# EAGLE design ESP32Board (EAGLE 9.6.2)
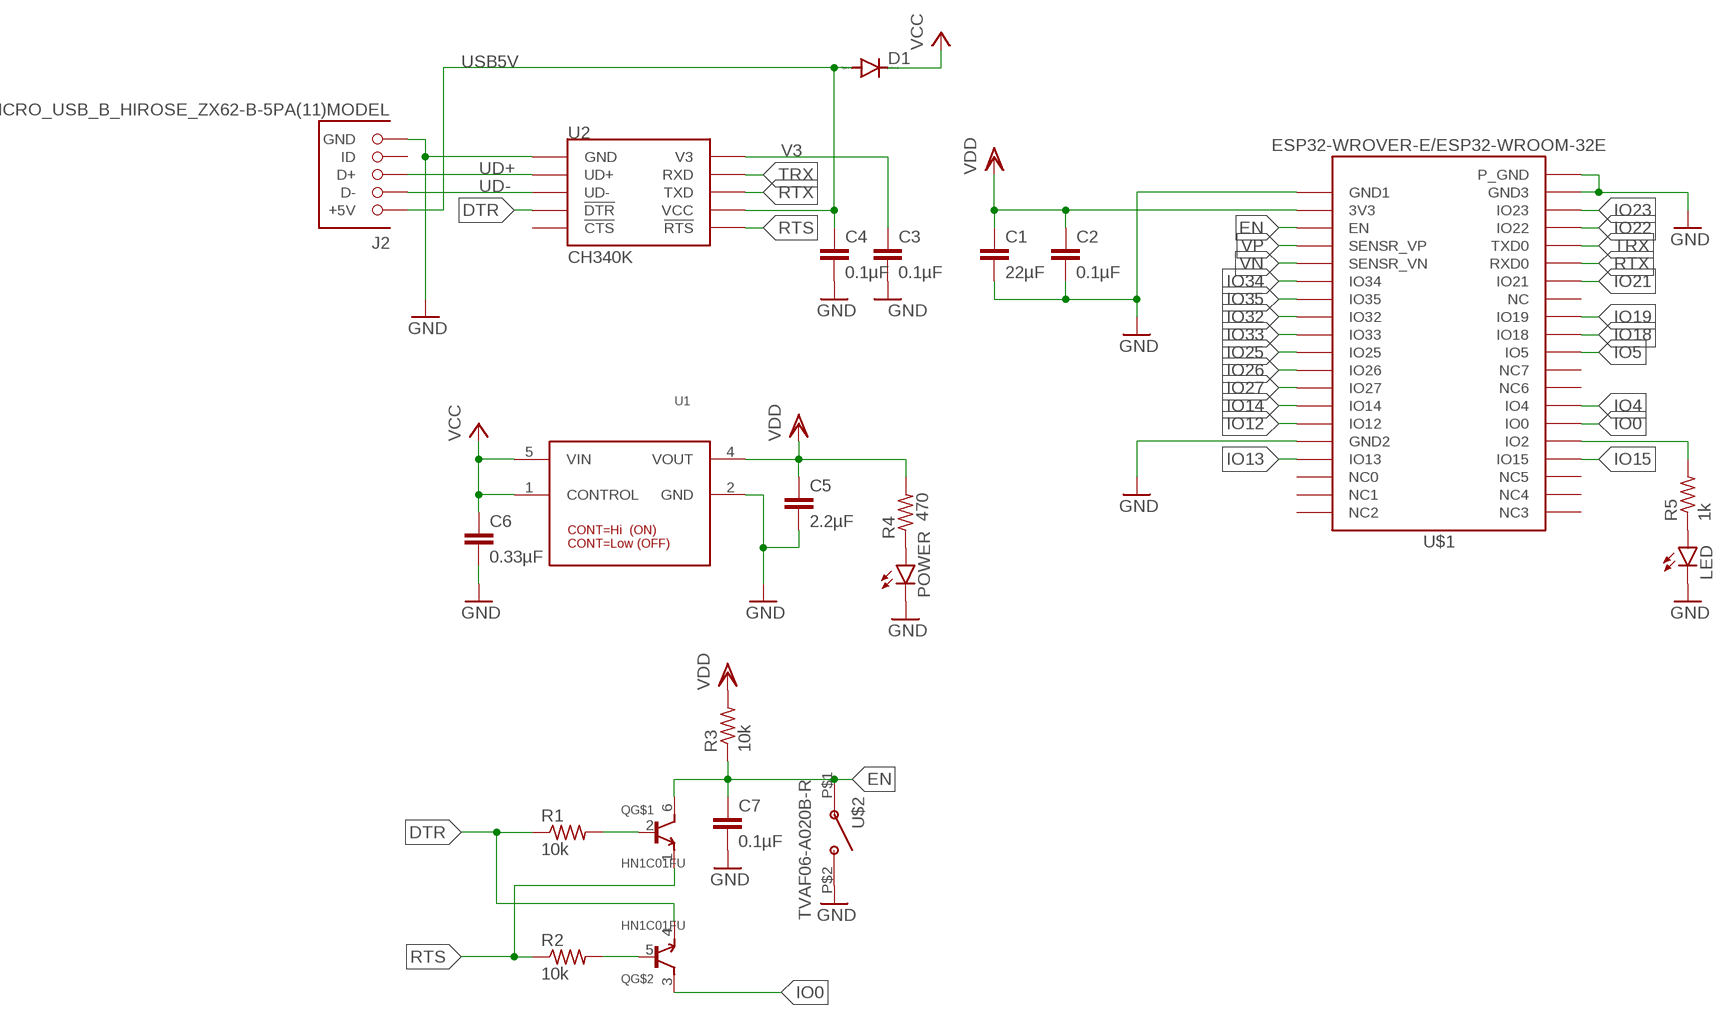
[diagram p0: schematic, sheet 1]

## Parts
C1  22µF  C-EUC0603K  [C0603K]
C2  0.1µF  C-EUC0603K  [C0603K]
C3  0.1µF  C-EUC0603K  [C0603K]
C4  0.1µF  C-EUC0603K  [C0603K]
C5  2.2µF  C-EUC0603K  [C0603K]
C6  0.33µF  C-EUC0603K  [C0603K]
C7  0.1µF  C-EUC0603K  [C0603K]
D1  DIODE-SOD123  [SOD123]
J2  MICRO_USB_B_HIROSE_ZX62-B-5PA(11)MODEL  [GHI-CONNECTORS_10118192-0001LF(MICRO-USB-B-AMPHENOL-FCI)]
LED  LEDCHIPLED_0603  [CHIPLED_0603]
POWER  LEDCHIPLED_0603  [CHIPLED_0603]
Q  HN1C01FU  [SOT-363]
R1  10k  R-US_R0603  [R0603]
R2  10k  R-US_R0603  [R0603]
R3  10k  R-US_R0603  [R0603]
R4  470  R-US_R0603  [R0603]
R5  1k  R-US_R0603  [R0603]
U1  I-10673_NJM2884U1-33  [NJM2884U1-33]
U2  CH340K  [ESSOP-10]
U$1  ESP32-WROVER-E/ESP32-WROOM-32E  [ESP32-WROVER-E/ESP32-WROOM-32E]
U$2  TVAF06-A020B-R  [TVAF06-A020B-R]

## Nets
DTR: Q.4(E) R1.1 U2.P4(!DTR!)
EN: C7.1 Q.6(C) R3.1 U$1.EN U$2.P$1(A)
GND: C1.2 C2.2 C3.2 C4.2 C5.2 C6.2 C7.2 J2.CGND1(GND) J2.CGND2(GND) J2.CGND3(GND) J2.CGND4(GND) J2.CGND5(GND) J2.CGND6(GND) J2.GND LED.C POWER.C U1.2(GND) U2.P0(GND) U2.P3(GND) U$1.GND1 U$1.GND2 U$1.GND2'(GND2) U$1.GND3 U$1.P_GND U$2.P$2(B)
IO0: Q.3(C) U$1.IO0
IO2: R5.2 U$1.IO2 U$1.IO2'(IO2)
IO4: U$1.IO4
IO5: U$1.IO5
IO12: U$1.IO12
IO13: U$1.IO13 U$1.IO13'(IO13)
IO14: U$1.IO14
IO15: U$1.IO15 U$1.IO15'(IO15)
IO18: U$1.IO18
IO19: U$1.IO19
IO21: U$1.IO21
IO22: U$1.IO22
IO23: U$1.IO23
IO25: U$1.IO25
IO26: U$1.IO26
IO27: U$1.IO27
IO32: U$1.IO32
IO33: U$1.IO33
IO34: U$1.IO34
IO35: U$1.IO35
N$1: LED.A R5.1
N$14: Q.2(B) R1.2
N$15: Q.5(B) R2.2
N$84: POWER.A R4.1
RTS: Q.1(E) R2.1 U2.P6(!RTS!)
RTX: U2.P8(TXD) U$1.RXD0
TRX: U2.P9(RXD) U$1.TXD0
UD+: J2.D+ U2.P1(UD+)
UD-: J2.D- U2.P2(UD-)
USB5V: C4.1 D1.A J2.VBUS(+5V) U2.P7(VCC)
V3: C3.1 U2.P10(V3)
VCC: C6.1 D1.C U1.1(CONTROL) U1.5(VIN)
VDD: C1.1 C2.1 C5.1 R3.2 R4.2 U1.4(VOUT) U$1.3V3
VN: U$1.SENSOR_VN(SENSR_VN)
VP: U$1.SENSOR_VP(SENSR_VP)
Unconnected: J2.ID U2.P5(!CTS!) U$1.IO16(NC6) U$1.IO17(NC7) U$1.NC U$1.NC0 U$1.NC0'(NC0) U$1.NC1 U$1.NC1'(NC1) U$1.NC2 U$1.NC2'(NC2) U$1.NC3 U$1.NC3'(NC3) U$1.NC4 U$1.NC4'(NC4) U$1.NC5 U$1.NC5'(NC5)

## Library data of the parts
C1-C7 = rcl:C-EU: CAPACITOR, European symbol; SPICEPREFIX: C
D1 = diode:DIODE-: DIODE
J2 = connector:MICRO_USB_B_HIROSE_ZX62-B-5PA(11): Connector Receptacle USB - micro B 2.0 5 Position Surface Mount, Right Angle, Horizontal Bottom Mount
LED POWER = led:LED: LED OSRAM: - CHIPLED LG R971, LG N971, LY N971, LG Q971, LY Q971, LO R971, LY R971 LH N974, LH R974 LS Q976, LO Q976, LY Q976 LO Q996 - Hyper CHIPLED LW Q18S LB Q993, LB Q99A, LB R99A - SideLED LS A670, LO A670, LY A670, LG A670, LP A670 LB A673, LV A673, LT A673, LW A673 LH A674 LY A675 LS A676, LA A676, LO A676, LY A676, LW A676 LS A679, LY A679, LG A679 - Hyper Micro SIDELED® LS Y876, LA Y876, LO Y876, LY Y876 LT Y87S - SmartLED LW L88C, LW L88S LB L89C, LB L89S, LG L890 LS L89K, LO L89K, LY L89K LS L896, LA L896, LO L896, LY L896 - TOPLED LS T670, LO T670, LY T670, LG T670, LP T670 LSG T670, LSP T670, LSY T670, LOP T670, LYG T670 LG T671, LOG T671, LSG T671 LB T673, LV T673, LT T673, LW T673 LH T674 LS T676, LA T676, LO T676, LY T676, LB T676, LH T676, LSB T676, LW T676 LB T67C, LV T67C, LT T67C, LS T67K, LO T67K, LY T67K, LW E67C LS E67B, LA E67B, LO E67B, LY E67B, LB E67C, LV E67C, LT E67C LW T67C LS T679, LY T679, LG T679 LS T770, LO T770, LY T770, LG T770, LP T770 LB T773, LV T773, LT T773, LW T773 LH T774 LS E675, LA E675, LY E675, LS T675 LS T776, LA T776, LO T776, LY T776, LB T776 LHGB T686 LT T68C, LB T68C - Hyper Mini TOPLED® LB M676 - Mini TOPLED Santana® LG M470 LS M47K, LO M47K, LY M47K Source: http://www.osram.convergy.de LUXEON: - LUMILED® LXK2-PW12-R00, LXK2-PW12-S00, LXK2-PW14-U00, LXK2-PW14-V00 LXK2-PM12-R00, LXK2-PM12-S00, LXK2-PM14-U00 LXK2-PE12-Q00, LXK2-PE12-R00, LXK2-PE12-S00, LXK2-PE14-T00, LXK2-PE14-U00 LXK2-PB12-K00, LXK2-PB12-L00, LXK2-PB12-M00, LXK2-PB14-N00, LXK2-PB14-P00, LXK2-PB14-Q00 LXK2-PR12-L00, LXK2-PR12-M00, LXK2-PR14-Q00, LXK2-PR14-R00 LXK2-PD12-Q00, LXK2-PD12-R00, LXK2-PD12-S00 LXK2-PH12-R00, LXK2-PH12-S00 LXK2-PL12-P00, LXK2-PL12-Q00, LXK2-PL12-R00 Source: www.luxeon.com KINGBRIGHT: KA-3528ASYC Source: www.kingbright.com
Q = transistors:HN1C01FU
R1-R5 = rcl:R-US_: RESISTOR, American symbol; SPICEPREFIX: R
U1 = akizuki:I-10673_NJM2884U1-33
U2 = CH340:CH340K
U$1 = esp32:ESP32-WROVER-E/ESP32-WROOM-32E
U$2 = switches:TVAF06-A020B-R

## Board
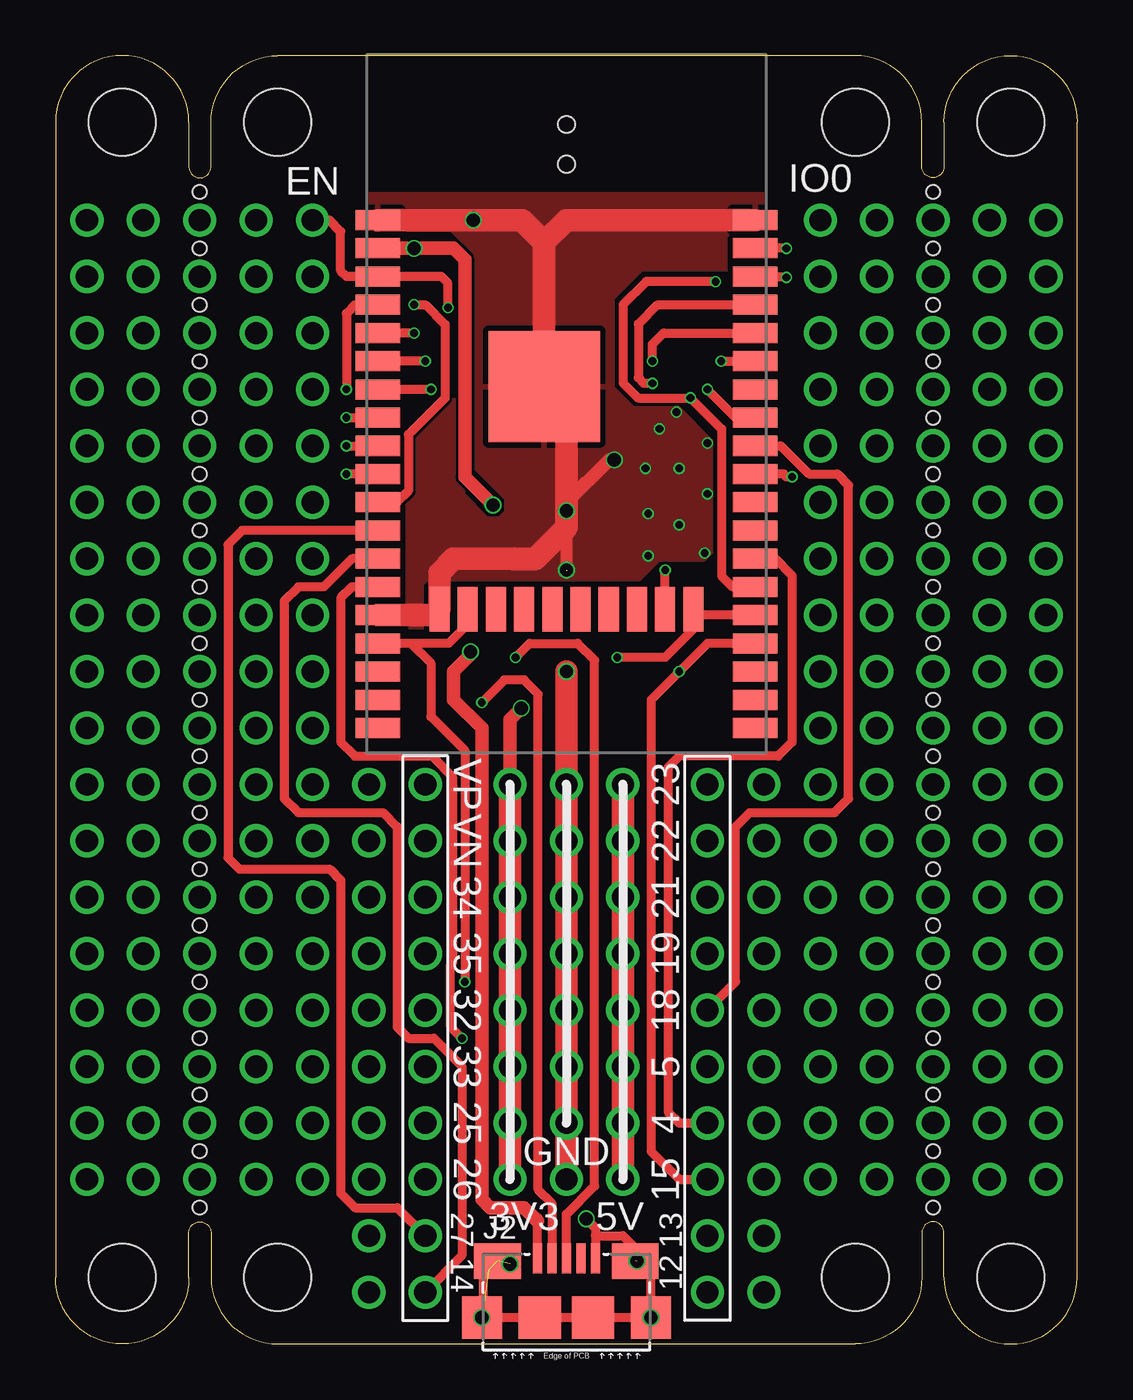
[diagram p1: board, top side]
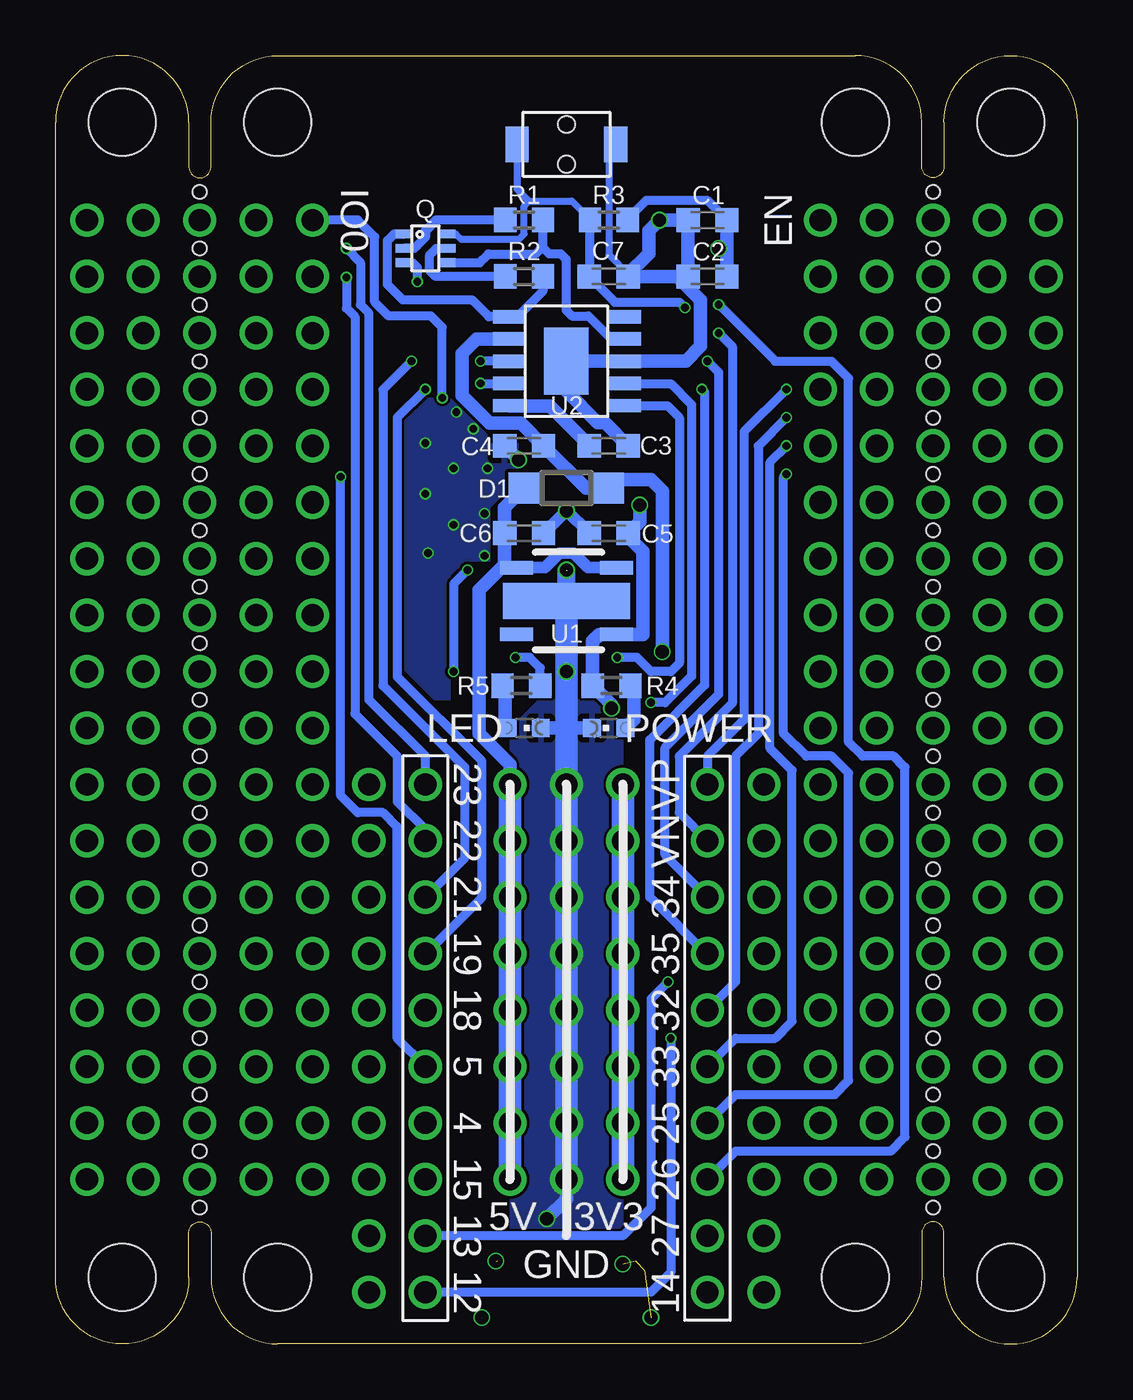
[diagram p2: board, bottom side, seen from below]

Size 46 x 58 mm. Coordinates in mm from the lower left corner, seen from the top.
Outline: 36,58 10,58 arc90 7,55 7,53 arc-180 6,53 6,55 arc180 0,55 0,3 arc180 6,3 6,5 arc-180 7,5 7,3 arc90 10,0 36,0 arc90 39,3 39,5 arc-180 40,5 40,3 arc180 46,3 46,55 arc180 40,55 40,53 arc-180 39,53 39,55 arc90 36,58
Copper layers (1*16): Top 0.035mm / dielectric 1mm / Bottom 0.035mm
Design rules "jlcpcb-2layers-1.0mm": minimum track width 5mil, minimum drill 0.3mm, track to track 5mil, track to pad 5mil, pad to pad 5mil, via to via 5mil, smd to smd 5mil, copper to edge 0.2mm, drill to drill 6mil, minimum pad ring 10mil, minimum via ring 3mil, stop-mask expansion 4mil, vias tented up to drill 0mil, thermal gap 10mil
Holes 3 mm at 10,55 3,55 36,55 43,55 36,3 43,3 10,3 3,3
Holes 0.6 mm at 6.49,49.32 6.49,46.78 6.49,44.24 6.49,41.7 6.49,39.16 6.49,36.62 6.49,34.08 6.49,31.54 6.49,29 6.49,26.46 6.49,23.92 6.49,21.38 6.49,18.84 6.49,16.3 6.49,13.76 6.49,11.22 6.49,8.68 6.49,6.14 6.49,51.86 39.51,51.86 39.51,49.32 39.51,46.78 39.51,44.24 39.51,41.7 39.51,39.16 39.51,36.62 39.51,34.08 39.51,31.54 39.51,29 39.51,26.46 39.51,23.92 39.51,21.38 39.51,18.84 39.51,16.3 39.51,13.76 39.51,11.22 39.51,8.68 39.51,6.14

### Footprints (pad centres in the part's own frame; a part is rotated, then mirrored left to right if it is on the bottom)
C0603K = smd 1.05 x 1.08: 1 -0.875,0; 2 0.875,0
SOD123 = smd 1.4 x 1.4: A 1.9,0; C -1.9,0
GHI-CONNECTORS_10118192-0001LF(MICRO-USB-B-AMPHENOL-FCI) = smd 1.8 x 1.9: CGND1 -3.8,0; CGND4 3.8,0 | smd 1.9 x 1.9: CGND2 -1.2,0; CGND3 1.2,0 | smd 2.1 x 1.6: CGND5 3.1,2.55; CGND6 -3.1,2.55 | smd 0.4 x 1.35: D+ 0,2.675; D- -0.65,2.675; GND 1.3,2.675; ID 0.65,2.675; VBUS -1.3,2.675
CHIPLED_0603 = smd 0.8 x 0.8: A 0,-0.75; C 0,0.75
SOT-363 = smd 0.4 x 0.8: 1 -0.65,-0.95; 2 0,-0.95; 3 0.65,-0.95; 4 0.65,0.95; 5 0,0.95; 6 -0.65,0.95
R0603 = smd 1 x 1.1: 1 -0.85,0; 2 0.85,0
NJM2884U1-33 = smd 0.6 x 1.5: 1 -1.5,-2.25; 3 1.5,-2.25; 4 1.5,2.25; 5 -1.5,2.25 | smd 1.6 x 5.7: 2 0,0
ESSOP-10 = smd 2 x 3: P0 0,0 | smd 1.5 x 0.6: P1 -2.6,2; P2 -2.6,1; P3 -2.6,0; P4 -2.6,-1; P5 -2.6,-2 | smd 1.4 x 0.6: P6 2.6,-2; P7 2.6,-1; P8 2.6,0; P9 2.6,1; P10 2.6,2
ESP32-WROVER-E/ESP32-WROOM-32E = smd 2 x 0.9: 3V3 -8.5,10.16; EN -8.5,8.89; GND1 -8.5,11.43; GND2 -8.5,-6.35; GND3 8.5,11.43; IO0 8.5,-5.08; IO2 8.5,-6.35; IO4 8.5,-3.81; IO5 8.5,0; IO12 -8.5,-5.08; IO13 -8.5,-7.62; IO14 -8.5,-3.81; IO15 8.5,-7.62; IO16 8.5,-2.54; IO17 8.5,-1.27; IO18 8.5,1.27; IO19 8.5,2.54; IO21 8.5,5.08; IO22 8.5,8.89; IO23 8.5,10.16; IO25 -8.5,0; IO26 -8.5,-1.27; IO27 -8.5,-2.54; IO32 -8.5,2.54; IO33 -8.5,1.27; IO34 -8.5,5.08; IO35 -8.5,3.81; NC 8.5,3.81; NC0 -8.5,-8.89; NC1 -8.5,-10.16; NC2 -8.5,-11.43; NC3 8.5,-11.43; NC4 8.5,-10.16; NC5 8.5,-8.89; RXD0 8.5,6.35; SENSOR_VN -8.5,6.35; SENSOR_VP -8.5,7.62; TXD0 8.5,7.62 | smd 0.9 x 2: GND2' -5.715,-6.08; IO2' 5.715,-6.08; IO13' -4.445,-6.08; IO15' 4.445,-6.08; NC0' -3.175,-6.08; NC1' -1.905,-6.08; NC2' -0.635,-6.08; NC3' 0.635,-6.08; NC4' 1.905,-6.08; NC5' 3.175,-6.08 | smd 5 x 5: P_GND -1,3.93
TVAF06-A020B-R = smd 1.6 x 1.05: P$1 0,2.225; P$2 0,-2.225 | hole 0.75: -0.9,0; 0.9,0

### Placement (x,y rotation side)
C1  16.65,50.59 180 bottom
C2  16.65,48.05 180 bottom
C3  21.09,40.43 0 bottom
C4  24.91,40.43 180 bottom
C5  21.09,36.49 180 bottom
C6  24.91,36.49 0 bottom
C7  21.09,48.05 0 bottom
D1  23,38.52 0 bottom
J2  23,1.19 0 top
LED  24.91,27.73 270 bottom
POWER  21.09,27.73 90 bottom
Q  29.35,49.32 270 bottom
R1  24.91,50.59 180 bottom
R2  24.91,48.05 180 bottom
R3  21.09,50.59 0 bottom
R4  20.97,29.64 180 bottom
R5  25.03,29.64 0 bottom
U1  23,33.45 270 bottom
U2  23,44.24 180 bottom
U$1  23,39.16 0 top
U$2  23,54 90 bottom

### Tracks (layer width: path | path; a pad name or v marks a point on that pad's centre or on a via)
DTR
  Bottom 0.406: U2.P4 20.98,45.24 22.01,46.27 22.75,46.27 23,46.53 23,48.81 23.25,49.07 23.76,49.07 24.05,49.36 24.05,49.41 | Q.4 26.91,48.67 26.51,49.07 24.4,49.07 24.05,49.41 | 24.05,49.41 R1.1
EN  (via drill 0.35, 1 pad 1.5)
  Top 0.406: v17.67,46.65 17.67,47.75 17.37,48.05 U$1.EN 13.09,48.05 12.84,48.3 12.84,50.08 12.33,50.59 v11.57,50.59
  Bottom 0.305: R3.1 21.95,50.64 22.75,51.45 24.68,51.45 | 24.68,51.45 24.91,51.22 24.91,49.96 25.13,49.73 27.75,49.73 27.98,49.97 Q.6 | U$2.P$1 25.23,51.99 24.68,51.45
  Bottom 0.406: R3.1 21.97,50.56 C7.1 20.82,46.9 17.91,46.9 v17.67,46.65
GND  (via drill 0.35, 0.6, 1 pad 1.5)  (7 unrouted)
  Top 0.406: v23.89,5.63 24.3,5.22 24.3,4.87 | 24.3,4.87 J2.GND | 19.48,3.32 19.26,3.1 19.26,1.19 J2.CGND2 J2.CGND3 J2.CGND4 26.8,3.04 J2.CGND5 26.1,4.31 25.54,4.87 24.3,4.87
  Top 0.508: v23,34.84 v23,37.51
  Top 0.61: v23,37.51 23,37.89 24.91,39.8 v25.16,39.8
  Top 1.016: v23,7.41 v23,9.95 v23,12.49 v23,15.03 v23,17.57 v23,20.11 v23,22.65 v23,25.19 v23,30.27 | U$1.GND2 17.02,32.81 U$1.GND2' 17.29,34.72 17.92,35.35 20.59,35.35 20.61,35.33 21.58,35.33 23,36.75 v23,37.51 23,42.09 U$1.P_GND 22,49.59 | U$1.GND3 23,50.59 22,49.59 | U$1.GND1 v18.81,50.59 21,50.59 22,49.59
  Bottom 0.305: U$2.P$2 21.09,53.68 21.09,49.03 20.22,48.16
  Bottom 0.508: C5.2 22.99,37.51 v23,37.51 24.02,36.49 C6.2
  Bottom 0.61: C3.2 21.27,41.48 21.59,41.48 23,42.89 U2.P0 U2.P3 17.63,44.24 16.96,44.91 16.96,47 18.01,48.05 C7.2 | C7.2 C2.2 C1.2 v18.81,50.59 19.29,50.11 19.29,49.09 20.22,48.16 C7.2 | LED.C 23,27.73 POWER.C | v23,7.41 23,6.52 v23.89,5.63 | v25.16,39.8 25.16,39.81 C4.2
  Bottom 0.813: U1.2 23,34.8
  Bottom 1.016: U1.2 v23,30.27 23,27.73 v23,25.19 v23,7.41
  other vias: 29.35,40.56 27.95,41.95 28.08,39.41 27.19,41.19 26.56,39.41 26.68,37.38 28.08,36.87 29.22,35.6 26.68,35.48 29.35,38.27 26.18,3.73 20.46,3.6 19.19,1.19 26.81,1.19
  pour Top: 14.11,51.86 31.89,51.86 31.89,50.59 30.62,50.59 30.62,50.21 30.24,49.83 30.24,48.3 26.43,48.3 25.16,47.03 25.16,43.1 26.05,42.21 28.08,42.21 29.6,40.68 29.6,35.6 29.22,35.22 27.19,35.22 26.3,34.33 17.54,34.33 17.54,32.3 17.41,32.17 15.89,32.17 15.89,32.3 15.76,32.43 15.76,42.59 18.43,42.59 18.43,38.27 19.44,37.26 19.95,37.26 20.21,37.51 20.21,38.02 18.81,39.41 18.81,49.07 17.79,50.08 14.11,50.08
  pour Bottom: 28.21,42.59 30.11,42.59 30.87,41.83 30.87,30.91 28.97,29 28.21,29 28.21,34.59 27.57,35.22 26.43,35.22 26.43,37.64 25.79,38.27 25.79,39.29 25.67,39.41 25.16,39.41 25.16,40.81 25.29,40.94 26.56,40.94
  pour Bottom: 23,29 21.73,29 20.46,27.73 20.46,6.14 20.46,4.87 25.54,4.87 25.54,27.73 24.27,29
IO0  (via drill 0.35, 1 pad 1.5)
  Top 0.406: U$1.IO0 30.48,34.08 29.98,34.58 29.98,41.19 v28.59,42.59 26.22,42.59 25.55,43.26 25.55,46.78 26.59,47.82 v29.71,47.82
  Bottom 0.406: Q.3 29.92,48.67 29.71,48.47 v29.71,47.82 | v28.59,42.59 28.59,45.76 29.1,46.27 31,46.27 31.64,46.91 31.64,49.83 32.4,50.59 v34.43,50.59
IO2  (via drill 0.35)
  Top 0.406: U$1.IO2 28.98,32.81 U$1.IO2' 28.71,32.17 27.45,30.91 v25.29,30.91
  Bottom 0.406: R5.2 24.18,30.44 24.65,30.91 v25.29,30.91
IO4  (via drill 1 pad 1.5)
  Top 0.406: U$1.IO4 32.4,35.35 33.16,34.59 33.16,27.09 32.52,26.46 28.08,26.46 27.57,25.95 27.57,10.46 28.08,9.95 v29.35,9.95
IO5  (via drill 0.35, 1 pad 1.5)
  Top 0.406: v33.16,39.03 32.9,39.03 32.77,39.16 U$1.IO5
  Bottom 0.406: v29.35,12.49 30.62,13.76 30.62,23.29 31.26,23.92 32.4,23.92 33.16,24.68 v33.16,39.03
IO12  (via drill 0.35, 1 pad 1.5)
  Top 0.406: U$1.IO12 13.35,34.08 12.84,33.57 12.84,27.09 13.47,26.46 16.94,26.46 17.87,25.53 17.87,17.14 17.79,17.06 17.79,14.27 v18.3,13.76
  Bottom 0.406: v18.3,13.76 18.3,3.22 19.19,2.33 v29.35,2.33
IO13  (via drill 0.35, 1 pad 1.5)
  Top 0.406: U$1.IO13' 18.47,33 18.47,32.31 17.7,31.54 16.02,31.54 | 16.02,31.54 U$1.IO13 | 16.02,31.54 16.9,30.65 16.9,28.24 18.43,26.71 v18.43,16.3
  Bottom 0.406: v18.43,16.3 19.19,15.54 19.19,6.14 20.46,4.87 v29.35,4.87
IO14  (via drill 1 pad 1.5)
  Top 0.406: U$1.IO14 13.35,35.35 12.08,34.08 10.94,34.08 10.3,33.45 10.3,24.55 10.94,23.92 14.74,23.92 15.38,23.29 15.38,14.27 15.89,13.76 17.03,13.76 18.3,12.49 18.3,3.98 v16.65,2.33
IO15  (via drill 0.35, 1 pad 1.5)
  Top 0.406: U$1.IO15 29.35,31.54 v28.08,30.27 26.81,29 26.81,8.68 28.08,7.41 v29.35,7.41 | U$1.IO15' v27.45,34.84
  Bottom 0.406: v27.45,34.84 28.08,34.21 v28.08,30.27
IO18  (via drill 1 pad 1.5)
  Top 0.406: v29.35,15.03 30.62,16.3 30.62,23.29 31.26,23.92 35.06,23.92 35.7,24.55 35.7,38.65 35.19,39.16 33.92,39.16 32.65,40.43 U$1.IO18
IO19  (via drill 0.35, 1 pad 1.5)
  Top 0.406: U$1.IO19 30.62,41.7 v29.35,42.97
  Bottom 0.406: v29.35,17.57 26.81,20.11 26.81,26.23 30.62,30.04 30.62,41.7 v29.35,42.97
IO21  (via drill 0.35, 1 pad 1.5)
  Top 0.406: v29.97,44.24 U$1.IO21
  Bottom 0.406: v29.35,20.11 27.57,21.89 27.57,25.95 31.26,29.64 31.26,42.95 v29.97,44.24
IO22  (via drill 0.35, 1 pad 1.5)
  Top 0.406: U$1.IO22 32.91,48.05 v32.91,48.02
  Bottom 0.406: v32.91,48.02 32.91,46.62 32.52,46.24 32.52,28.36 30.62,26.46 30.62,24.43 29.35,23.16 v29.35,22.65
IO23  (via drill 0.35, 1 pad 1.5)
  Top 0.406: v32.91,49.32 U$1.IO23
  Bottom 0.406: v29.35,25.19 29.35,26.46 31.89,29 31.89,46.4 32.27,46.78 32.27,48.69 v32.91,49.32
IO25  (via drill 0.35, 1 pad 1.5)
  Top 0.406: U$1.IO25 v13.09,39.16
  Bottom 0.406: v16.65,9.95 15.38,11.22 10.94,11.22 10.3,11.86 10.3,25.7 11.06,26.46 12.21,26.46 13.22,27.48 13.22,39.03 v13.09,39.16
IO26  (via drill 0.35, 1 pad 1.5)
  Top 0.406: v16.14,46.78 16.65,46.78 17.54,45.89 17.54,42.59 15.89,40.94 15.89,38.4 15.38,37.89 U$1.IO26
  Bottom 0.406: v16.65,7.41 15.38,8.68 8.39,8.68 7.76,9.32 7.76,25.95 8.27,26.46 9.66,26.46 10.3,27.09 10.3,43.48 11.06,44.24 13.6,44.24 v16.14,46.78
IO27  (via drill 1 pad 1.5)
  Top 0.406: U$1.IO27 8.39,36.62 7.76,35.98 7.76,21.89 8.27,21.38 12.33,21.38 12.84,20.87 12.84,6.77 13.47,6.14 15.38,6.14 v16.65,4.87
IO32  (via drill 0.35, 1 pad 1.5)
  Top 0.406: v13.09,41.7 U$1.IO32
  Bottom 0.406: v16.65,15.03 15.38,16.3 15.38,26.46 14.36,27.48 14.36,40.43 v13.09,41.7
IO33  (via drill 0.35, 1 pad 1.5)
  Top 0.406: v13.09,40.43 U$1.IO33
  Bottom 0.406: v16.65,12.49 15.38,13.76 13.6,13.76 12.84,14.52 12.84,25.82 13.83,26.82 13.83,39.69 v13.09,40.43
IO34  (via drill 0.35, 1 pad 1.5)
  Top 0.406: v16.65,44.24 U$1.IO34
  Bottom 0.406: v16.65,20.11 18.55,22.02 18.55,26.84 16.14,29.25 16.14,43.73 v16.65,44.24
IO35  (via drill 0.35, 1 pad 1.5)
  Top 0.406: v16.9,42.97 U$1.IO35
  Bottom 0.406: v16.65,17.57 16.69,17.57 19.24,20.12 19.24,27.2 16.78,29.66 16.78,42.84 v16.9,42.97
N$1
  Bottom 0.61: R5.1 25.75,29.51 25.75,27.83 LED.A
N$2  (via drill 1 pad 1.5)
  other vias: 39.51,25.19
N$3  (via drill 1 pad 1.5)
  other vias: 39.51,22.65
N$4  (via drill 1 pad 1.5)
  other vias: 39.51,20.11
N$5  (via drill 1 pad 1.5)
  other vias: 39.51,17.57
N$6  (via drill 1 pad 1.5)
  other vias: 39.51,15.03
N$7  (via drill 1 pad 1.5)
  other vias: 39.51,12.49
N$8  (via drill 1 pad 1.5)
  other vias: 39.51,9.95
N$9  (via drill 1 pad 1.5)
  other vias: 31.89,25.19
N$10  (via drill 1 pad 1.5)
  other vias: 31.89,22.65
N$11  (via drill 1 pad 1.5)
  other vias: 31.89,20.11
N$12  (via drill 1 pad 1.5)
  other vias: 31.89,17.57
N$13  (via drill 1 pad 1.5)
  other vias: 39.51,37.89
N$14
  Bottom 0.406: Q.2 29.85,49.32 29.35,49.82 29.35,50.12 28.88,50.59 R1.2
N$15
  Bottom 0.406: Q.5 28.85,49.32 29.16,49.02 29.16,48.32 28.88,48.05 R2.2
N$16  (via drill 1 pad 1.5)
  other vias: 14.11,7.41
N$17  (via drill 1 pad 1.5)
  other vias: 11.57,7.41
N$18  (via drill 1 pad 1.5)
  other vias: 9.03,7.41
N$19  (via drill 1 pad 1.5)
  other vias: 39.51,35.35
N$20  (via drill 1 pad 1.5)
  other vias: 14.11,4.87
N$21  (via drill 1 pad 1.5)
  other vias: 39.51,32.81
N$22  (via drill 1 pad 1.5)
  other vias: 31.89,15.03
N$23  (via drill 1 pad 1.5)
  other vias: 39.51,30.27
N$24  (via drill 1 pad 1.5)
  other vias: 36.97,7.41
N$25  (via drill 1 pad 1.5)
  other vias: 31.89,12.49
N$26  (via drill 1 pad 1.5)
  other vias: 31.89,9.95
N$27  (via drill 1 pad 1.5)
  other vias: 31.89,2.33
N$28  (via drill 1 pad 1.5)
  other vias: 34.43,25.19
N$29  (via drill 1 pad 1.5)
  other vias: 34.43,22.65
N$30  (via drill 1 pad 1.5)
  other vias: 34.43,20.11
N$31  (via drill 1 pad 1.5)
  other vias: 34.43,17.57
N$32  (via drill 1 pad 1.5)
  other vias: 34.43,15.03
N$33  (via drill 1 pad 1.5)
  other vias: 34.43,12.49
N$34  (via drill 1 pad 1.5)
  other vias: 34.43,9.95
N$35  (via drill 1 pad 1.5)
  other vias: 39.51,27.73
N$36  (via drill 1 pad 1.5)
  other vias: 36.97,25.19
N$37  (via drill 1 pad 1.5)
  other vias: 36.97,22.65
N$38  (via drill 1 pad 1.5)
  other vias: 36.97,20.11
N$39  (via drill 1 pad 1.5)
  other vias: 36.97,17.57
N$40  (via drill 1 pad 1.5)
  other vias: 36.97,15.03
N$41  (via drill 1 pad 1.5)
  other vias: 36.97,12.49
N$42  (via drill 1 pad 1.5)
  other vias: 36.97,9.95
N$43  (via drill 1 pad 1.5)
  other vias: 39.51,50.59
N$44  (via drill 1 pad 1.5)
  other vias: 39.51,48.05
N$45  (via drill 1 pad 1.5)
  other vias: 39.51,45.51
N$46  (via drill 1 pad 1.5)
  other vias: 39.51,42.97
N$47  (via drill 1 pad 1.5)
  other vias: 39.51,40.43
N$48  (via drill 1 pad 1.5)
  other vias: 39.51,7.41
N$52  (via drill 1 pad 1.5)
  other vias: 14.11,25.19
N$53  (via drill 1 pad 1.5)
  other vias: 14.11,22.65
N$54  (via drill 1 pad 1.5)
  other vias: 14.11,20.11
N$55  (via drill 1 pad 1.5)
  other vias: 14.11,17.57
N$56  (via drill 1 pad 1.5)
  other vias: 14.11,15.03
N$57  (via drill 1 pad 1.5)
  other vias: 14.11,12.49
N$58  (via drill 1 pad 1.5)
  other vias: 14.11,9.95
N$59  (via drill 1 pad 1.5)
  other vias: 14.11,2.33
N$60  (via drill 1 pad 1.5)
  other vias: 11.57,25.19
N$61  (via drill 1 pad 1.5)
  other vias: 11.57,22.65
N$62  (via drill 1 pad 1.5)
  other vias: 11.57,20.11
N$63  (via drill 1 pad 1.5)
  other vias: 11.57,17.57
N$64  (via drill 1 pad 1.5)
  other vias: 11.57,15.03
N$65  (via drill 1 pad 1.5)
  other vias: 11.57,12.49
N$66  (via drill 1 pad 1.5)
  other vias: 11.57,9.95
N$68  (via drill 1 pad 1.5)
  other vias: 9.03,25.19
N$69  (via drill 1 pad 1.5)
  other vias: 9.03,22.65
N$70  (via drill 1 pad 1.5)
  other vias: 9.03,20.11
N$71  (via drill 1 pad 1.5)
  other vias: 9.03,17.57
N$72  (via drill 1 pad 1.5)
  other vias: 9.03,15.03
N$73  (via drill 1 pad 1.5)
  other vias: 9.03,12.49
N$74  (via drill 1 pad 1.5)
  other vias: 9.03,9.95
N$75  (via drill 1 pad 1.5)
  other vias: 42.05,25.19
N$76  (via drill 1 pad 1.5)
  other vias: 42.05,22.65
N$77  (via drill 1 pad 1.5)
  other vias: 42.05,20.11
N$78  (via drill 1 pad 1.5)
  other vias: 42.05,17.57
N$79  (via drill 1 pad 1.5)
  other vias: 42.05,15.03
N$80  (via drill 1 pad 1.5)
  other vias: 42.05,12.49
N$81  (via drill 1 pad 1.5)
  other vias: 42.05,9.95
N$82  (via drill 1 pad 1.5)
  other vias: 42.05,37.89
N$83  (via drill 1 pad 1.5)
  other vias: 42.05,35.35
N$84
  Bottom 0.61: R4.1 19.96,29.48 19.96,28.11 POWER.A
N$85  (via drill 1 pad 1.5)
  other vias: 34.43,7.41
N$86  (via drill 1 pad 1.5)
  other vias: 31.89,7.41
N$87  (via drill 1 pad 1.5)
  other vias: 42.05,32.81
N$88  (via drill 1 pad 1.5)
  other vias: 42.05,30.27
N$89  (via drill 1 pad 1.5)
  other vias: 42.05,27.73
N$90  (via drill 1 pad 1.5)
  other vias: 31.89,4.87
N$91  (via drill 1 pad 1.5)
  other vias: 42.05,50.59
N$92  (via drill 1 pad 1.5)
  other vias: 42.05,48.05
N$93  (via drill 1 pad 1.5)
  other vias: 42.05,45.51
N$94  (via drill 1 pad 1.5)
  other vias: 42.05,42.97
N$95  (via drill 1 pad 1.5)
  other vias: 42.05,40.43
N$96  (via drill 1 pad 1.5)
  other vias: 42.05,7.41
N$97  (via drill 1 pad 1.5)
  other vias: 11.57,37.89
N$98  (via drill 1 pad 1.5)
  other vias: 11.57,35.35
N$99  (via drill 1 pad 1.5)
  other vias: 11.57,32.81
N$100  (via drill 1 pad 1.5)
  other vias: 11.57,30.27
N$101  (via drill 1 pad 1.5)
  other vias: 11.57,27.73
N$102  (via drill 1 pad 1.5)
  other vias: 9.03,37.89
N$103  (via drill 1 pad 1.5)
  other vias: 9.03,35.35
N$104  (via drill 1 pad 1.5)
  other vias: 9.03,32.81
N$105  (via drill 1 pad 1.5)
  other vias: 9.03,30.27
N$106  (via drill 1 pad 1.5)
  other vias: 9.03,27.73
N$108  (via drill 1 pad 1.5)
  other vias: 11.57,48.05
N$109  (via drill 1 pad 1.5)
  other vias: 11.57,45.51
N$110  (via drill 1 pad 1.5)
  other vias: 11.57,42.97
N$111  (via drill 1 pad 1.5)
  other vias: 11.57,40.43
N$112  (via drill 1 pad 1.5)
  other vias: 9.03,50.59
N$113  (via drill 1 pad 1.5)
  other vias: 9.03,48.05
N$114  (via drill 1 pad 1.5)
  other vias: 9.03,45.51
N$115  (via drill 1 pad 1.5)
  other vias: 9.03,42.97
N$116  (via drill 1 pad 1.5)
  other vias: 9.03,40.43
N$117  (via drill 1 pad 1.5)
  other vias: 36.97,37.89
N$118  (via drill 1 pad 1.5)
  other vias: 36.97,35.35
N$119  (via drill 1 pad 1.5)
  other vias: 36.97,32.81
N$120  (via drill 1 pad 1.5)
  other vias: 36.97,30.27
N$121  (via drill 1 pad 1.5)
  other vias: 36.97,27.73
N$122  (via drill 1 pad 1.5)
  other vias: 34.43,37.89
N$123  (via drill 1 pad 1.5)
  other vias: 34.43,35.35
N$124  (via drill 1 pad 1.5)
  other vias: 34.43,32.81
N$125  (via drill 1 pad 1.5)
  other vias: 34.43,30.27
N$126  (via drill 1 pad 1.5)
  other vias: 34.43,27.73
N$127  (via drill 1 pad 1.5)
  other vias: 36.97,50.59
N$128  (via drill 1 pad 1.5)
  other vias: 36.97,48.05
N$129  (via drill 1 pad 1.5)
  other vias: 36.97,45.51
N$130  (via drill 1 pad 1.5)
  other vias: 36.97,42.97
N$131  (via drill 1 pad 1.5)
  other vias: 36.97,40.43
N$133  (via drill 1 pad 1.5)
  other vias: 34.43,48.05
N$134  (via drill 1 pad 1.5)
  other vias: 34.43,45.51
N$135  (via drill 1 pad 1.5)
  other vias: 34.43,42.97
N$136  (via drill 1 pad 1.5)
  other vias: 34.43,40.43
N$141  (via drill 1 pad 1.5)
  other vias: 44.59,25.19
N$142  (via drill 1 pad 1.5)
  other vias: 44.59,22.65
N$143  (via drill 1 pad 1.5)
  other vias: 44.59,20.11
N$144  (via drill 1 pad 1.5)
  other vias: 44.59,17.57
N$145  (via drill 1 pad 1.5)
  other vias: 44.59,15.03
N$146  (via drill 1 pad 1.5)
  other vias: 44.59,12.49
N$147  (via drill 1 pad 1.5)
  other vias: 44.59,9.95
N$148  (via drill 1 pad 1.5)
  other vias: 44.59,37.89
N$149  (via drill 1 pad 1.5)
  other vias: 44.59,35.35
N$150  (via drill 1 pad 1.5)
  other vias: 44.59,32.81
N$151  (via drill 1 pad 1.5)
  other vias: 44.59,30.27
N$152  (via drill 1 pad 1.5)
  other vias: 44.59,27.73
N$153  (via drill 1 pad 1.5)
  other vias: 44.59,50.59
N$154  (via drill 1 pad 1.5)
  other vias: 44.59,48.05
N$155  (via drill 1 pad 1.5)
  other vias: 44.59,45.51
N$156  (via drill 1 pad 1.5)
  other vias: 44.59,42.97
N$157  (via drill 1 pad 1.5)
  other vias: 44.59,40.43
N$158  (via drill 1 pad 1.5)
  other vias: 44.59,7.41
N$163  (via drill 1 pad 1.5)
  other vias: 6.49,25.19
N$164  (via drill 1 pad 1.5)
  other vias: 6.49,22.65
N$165  (via drill 1 pad 1.5)
  other vias: 6.49,20.11
N$166  (via drill 1 pad 1.5)
  other vias: 6.49,17.57
N$167  (via drill 1 pad 1.5)
  other vias: 6.49,15.03
N$168  (via drill 1 pad 1.5)
  other vias: 6.49,12.49
N$169  (via drill 1 pad 1.5)
  other vias: 6.49,9.95
N$170  (via drill 1 pad 1.5)
  other vias: 6.49,37.89
N$171  (via drill 1 pad 1.5)
  other vias: 6.49,35.35
N$172  (via drill 1 pad 1.5)
  other vias: 6.49,32.81
N$173  (via drill 1 pad 1.5)
  other vias: 6.49,30.27
N$174  (via drill 1 pad 1.5)
  other vias: 6.49,27.73
N$175  (via drill 1 pad 1.5)
  other vias: 6.49,50.59
N$176  (via drill 1 pad 1.5)
  other vias: 6.49,48.05
N$177  (via drill 1 pad 1.5)
  other vias: 6.49,45.51
N$178  (via drill 1 pad 1.5)
  other vias: 6.49,42.97
N$179  (via drill 1 pad 1.5)
  other vias: 6.49,40.43
N$180  (via drill 1 pad 1.5)
  other vias: 6.49,7.41
N$185  (via drill 1 pad 1.5)
  other vias: 3.95,25.19
N$186  (via drill 1 pad 1.5)
  other vias: 3.95,22.65
N$187  (via drill 1 pad 1.5)
  other vias: 3.95,20.11
N$188  (via drill 1 pad 1.5)
  other vias: 3.95,17.57
N$189  (via drill 1 pad 1.5)
  other vias: 3.95,15.03
N$190  (via drill 1 pad 1.5)
  other vias: 3.95,12.49
N$191  (via drill 1 pad 1.5)
  other vias: 3.95,9.95
N$192  (via drill 1 pad 1.5)
  other vias: 3.95,37.89
N$193  (via drill 1 pad 1.5)
  other vias: 3.95,35.35
N$194  (via drill 1 pad 1.5)
  other vias: 3.95,32.81
N$195  (via drill 1 pad 1.5)
  other vias: 3.95,30.27
N$196  (via drill 1 pad 1.5)
  other vias: 3.95,27.73
N$197  (via drill 1 pad 1.5)
  other vias: 3.95,50.59
N$198  (via drill 1 pad 1.5)
  other vias: 3.95,48.05
N$199  (via drill 1 pad 1.5)
  other vias: 3.95,45.51
N$200  (via drill 1 pad 1.5)
  other vias: 3.95,42.97
N$201  (via drill 1 pad 1.5)
  other vias: 3.95,40.43
N$202  (via drill 1 pad 1.5)
  other vias: 3.95,7.41
N$207  (via drill 1 pad 1.5)
  other vias: 1.41,25.19
N$208  (via drill 1 pad 1.5)
  other vias: 1.41,22.65
N$209  (via drill 1 pad 1.5)
  other vias: 1.41,20.11
N$210  (via drill 1 pad 1.5)
  other vias: 1.41,17.57
N$211  (via drill 1 pad 1.5)
  other vias: 1.41,15.03
N$212  (via drill 1 pad 1.5)
  other vias: 1.41,12.49
N$213  (via drill 1 pad 1.5)
  other vias: 1.41,9.95
N$214  (via drill 1 pad 1.5)
  other vias: 1.41,37.89
N$215  (via drill 1 pad 1.5)
  other vias: 1.41,35.35
N$216  (via drill 1 pad 1.5)
  other vias: 1.41,32.81
N$217  (via drill 1 pad 1.5)
  other vias: 1.41,30.27
N$218  (via drill 1 pad 1.5)
  other vias: 1.41,27.73
N$219  (via drill 1 pad 1.5)
  other vias: 1.41,50.59
N$220  (via drill 1 pad 1.5)
  other vias: 1.41,48.05
N$221  (via drill 1 pad 1.5)
  other vias: 1.41,45.51
N$222  (via drill 1 pad 1.5)
  other vias: 1.41,42.97
N$223  (via drill 1 pad 1.5)
  other vias: 1.41,40.43
N$224  (via drill 1 pad 1.5)
  other vias: 1.41,7.41
RTS
  Bottom 0.406: R2.1 24.05,47.39 25.2,46.24 U2.P6 26.49,46.24 27.25,47 30.37,47 31.06,47.69 31.06,49.67 30.75,49.97 Q.1
RTX  (via drill 0.35)
  Top 0.406: U$1.RXD0 27.38,45.51 26.87,45 v26.87,44.24
  Bottom 0.406: U2.P8 v26.87,44.24
TRX  (via drill 0.35)
  Top 0.406: U$1.TXD0 27.1,46.78 26.23,45.91 26.23,43.49 26.49,43.24 v26.87,43.24
  Bottom 0.406: v26.87,43.24 U2.P9
UD+  (via drill 0.35)
  Top 0.406: v20.71,30.91 21.35,31.54 23.51,31.54 24.27,30.78 24.27,7.12 23,5.85 J2.D+
  Bottom 0.406: U2.P1 18.46,42.24 17.92,41.7 17.92,30.65 18.3,30.27 19.19,30.27 19.82,30.91 v20.71,30.91
UD-  (via drill 0.35)
  Top 0.406: v19.19,28.87 20.21,29.89 21.09,29.89 21.73,29.25 21.73,6.95 22.35,6.33 J2.D-
  Bottom 0.406: U2.P2 20.38,43.22 18.3,43.22 17.36,42.28 17.36,30.07 18.55,28.87 v19.19,28.87
USB5V  (via drill 0.6)
  Top 0.406: 21.41,5.82 21.22,6.01 | J2.VBUS 21.7,5.54 21.69,5.55
  Top 0.61: v18.68,31.16 18.68,31.03 17.92,30.27 17.92,29 19.19,27.73 19.19,6.52 19.57,6.14 21.09,6.14 21.41,5.82 21.69,5.55 21.69,5.54
  Bottom 0.406: U2.P7 26.91,45.24 27.6,44.54 27.6,44.24
  Bottom 0.61: v18.68,31.16 18.68,38.39 19.2,38.91 20.72,38.91 D1.A 22.12,38.52 C4.1 25.05,41.45 26.45,41.45 27.7,42.7 27.7,44.59 27.05,45.24 U2.P7
V3
  Bottom 0.61: U2.P10 25.57,42.21 23.73,42.21 21.97,40.45 C3.1
VCC  (via drill 1 pad 1.5)
  Top 1.016: v25.54,25.19 v25.54,22.65 v25.54,20.11 v25.54,17.57 v25.54,15.03 v25.54,12.49 v25.54,9.95 v25.54,7.41
  Bottom 0.508: U1.5 22.03,34.95 22.69,35.6 23.31,35.6 23.97,34.95 U1.1
  Bottom 0.61: D1.C 25.78,37.64 C6.1 25.78,34.95 U1.1 25.92,34.95 26.94,33.93 26.94,27.48 25.54,26.08 v25.54,25.19
  Bottom 1.016: v25.54,25.19 v25.54,7.41
VDD  (via drill 0.6, 1 pad 1.5)
  Top 0.61: U$1.3V3 v16.14,49.32 17.92,49.32 18.43,48.81 18.43,39.03 v19.7,37.76 | v20.46,25.19 20.46,28.11 v20.97,28.62
  Top 1.016: v20.46,7.41 v20.46,9.95 v20.46,12.49 v20.46,15.03 v20.46,17.57 v20.46,20.11 v20.46,22.65 v20.46,25.19
  Bottom 0.406: C1.1 15.78,50.61 16.66,51.49 19.4,51.49 20.25,50.64 R3.2
  Bottom 0.61: v19.7,37.76 19.7,37.02 C5.1 20.22,36.35 19.54,35.67 19.54,31.95 U1.4 21.51,31.95 21.82,31.64 R4.2 20.97,28.79 v20.97,28.62 | C1.1 15.78,49.33 15.79,49.32 v16.14,49.32 15.78,49.32 C2.1
  Bottom 1.016: v20.46,7.41 v20.46,25.19
VN  (via drill 0.35, 1 pad 1.5)
  Top 0.406: v16.14,45.51 U$1.SENSOR_VN
  Bottom 0.406: v16.65,22.65 17.92,23.92 17.92,26.46 15.53,28.85 15.53,44.9 v16.14,45.51
VP  (via drill 0.35, 1 pad 1.5)
  Top 0.406: v13.09,42.97 13.09,46.39 13.48,46.78 U$1.SENSOR_VP
  Bottom 0.406: v13.09,42.97 15,41.06 15,28.11 16.65,26.46 v16.65,25.19

### Text on the board
tNames: EN | IO0 | VP | 23 | VN | 22 | 34 | 21 | 35 | 19 | 32 | 18 | 33 | 5 | 25 | 4 | GND | 26 | 15 | 3V3 | 5V | 27 | 13 | 14 | 12
bNames: EN | IO0 | VP | 23 | VN | 22 | 34 | 21 | 35 | 19 | 32 | 18 | 33 | 5 | 25 | 4 | 26 | 15 | 3V3 | 5V | 27 | 13 | GND | 14 | 12